# Altium schematic sheet mcu.SchDoc
size 209 x 297 mm; DocumentCode: Децимальный номер; SchemeType: Схема электрическая принципиальная; PageSetup: Record=PageOptionsZCenterHorizontal=TrueZCenterVertical=TrueZPrintScale=0.95ZXCorrection=1.00ZYCorrection=1.00ZPrintKind=2ZBorderSize=5000000ZLeftOffset=0ZBottomOffset=0ZOrientation=1ZPaperLength=1000ZPaperWidth=1000ZScale=100ZPaperSource=7ZPrintQuality=600ZMediaType=1ZDitherType=10ZPaperKind=A4 (210 x 297 мм)ZPrintScaleMode=1
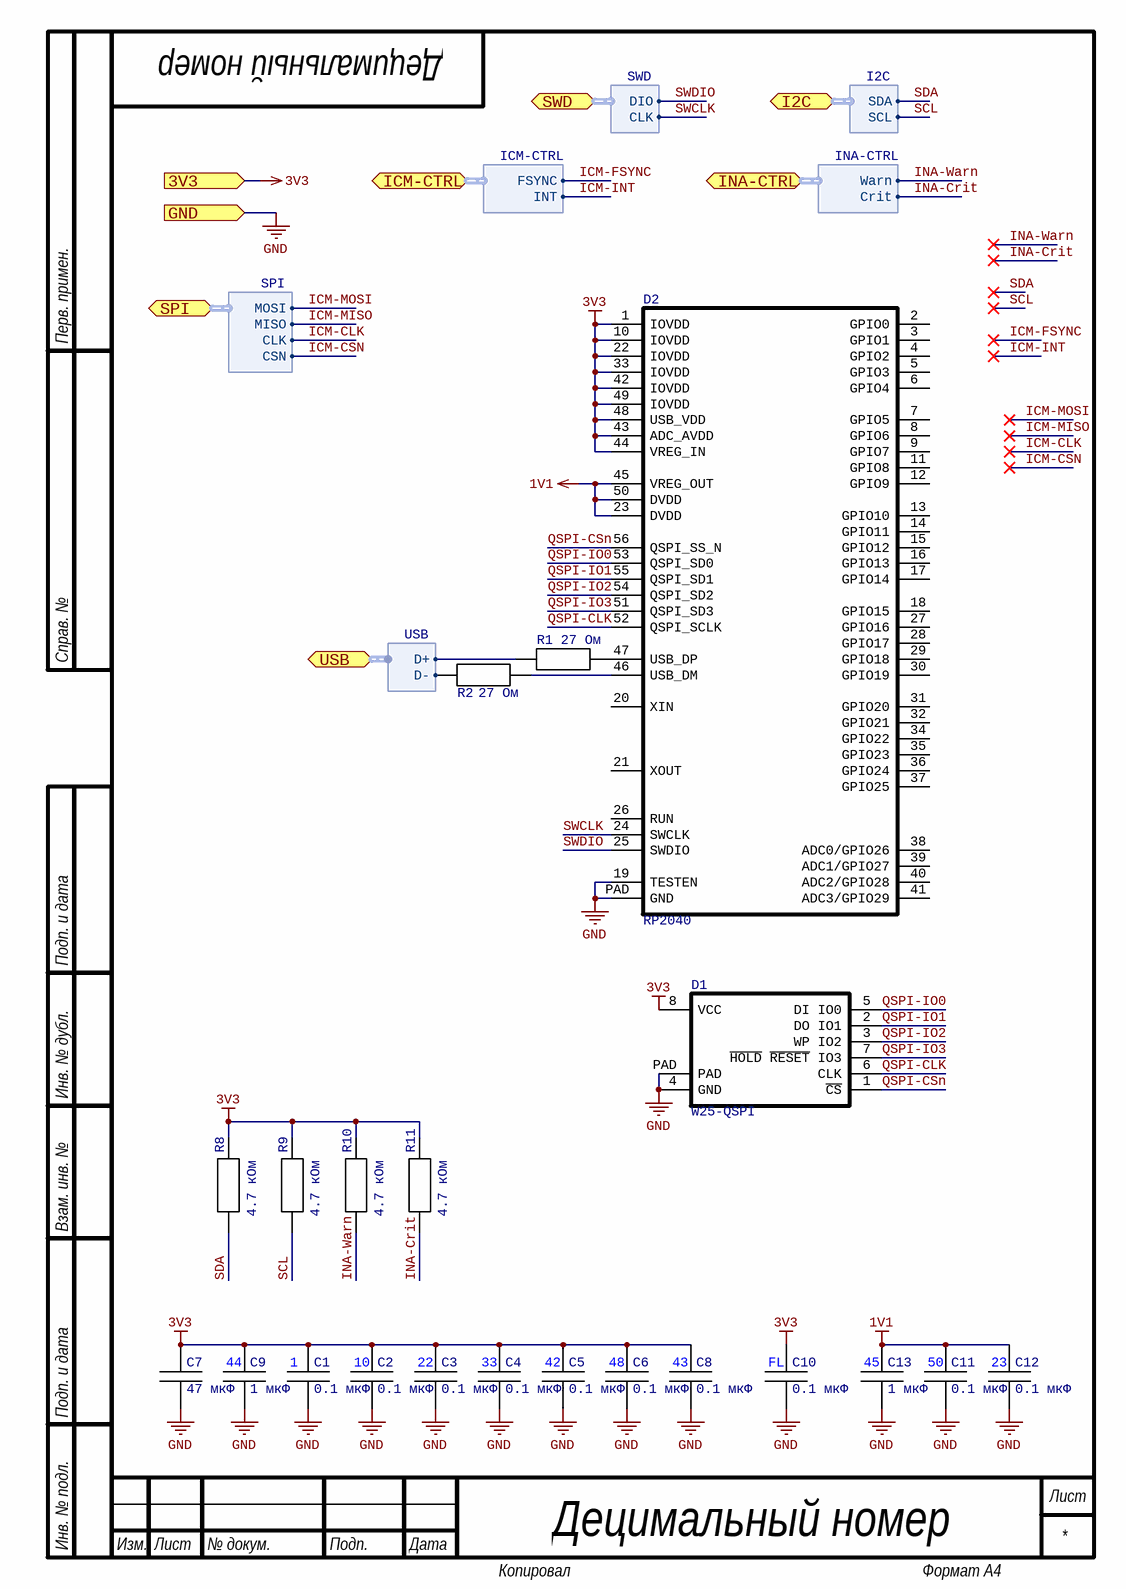
[diagram p0: mcu.SchDoc]

## Parts
C1  value 0.1 мкФ  [STD-0402]  (hidden comment: cap)
C2  value 0.1 мкФ  [STD-0402]  (hidden comment: cap)
C3  value 0.1 мкФ  [STD-0402]  (hidden comment: cap)
C4  value 0.1 мкФ  [STD-0402]  (hidden comment: cap)
C5  value 0.1 мкФ  [STD-0402]  (hidden comment: cap)
C6  value 0.1 мкФ  [STD-0402]  (hidden comment: cap)
C7  value 47 мкФ  [STD-0805]  (hidden comment: cap)
C8  value 0.1 мкФ  [STD-0402]  (hidden comment: cap)
C9  value 1 мкФ  [STD-0402]  (hidden comment: cap)
C10  value 0.1 мкФ  [STD-0402]  (hidden comment: cap)
C11  value 0.1 мкФ  [STD-0402]  (hidden comment: cap)
C12  value 0.1 мкФ  [STD-0402]  (hidden comment: cap)
C13  value 1 мкФ  [STD-0402]  (hidden comment: cap)
D1  W25-QSPI  [WSON-8]
D2  RP2040  [QFN-56]
R1  value 27 Ом  [STD-0402]  (hidden comment: res)
R2  value 27 Ом  [STD-0402]  (hidden comment: res)
R8  value 4.7 кОм  [STD-0402]  (hidden comment: res)
R9  value 4.7 кОм  [STD-0402]  (hidden comment: res)
R10  value 4.7 кОм  [STD-0402]  (hidden comment: res)
R11  value 4.7 кОм  [STD-0402]  (hidden comment: res)

## Ports
3V3 (in), GND (in), I2C (harness I2C), ICM-CTRL (harness ICM-CTRL), INA-CTRL (harness INA-CTRL), SPI (harness SPI), SWD (harness SWD), USB (harness USB)

## Harnesses
USB: D+, D-
I2C: SDA, SCL
INA-CTRL: Warn, Crit
SWD: DIO, CLK
ICM-CTRL: FSYNC, INT
SPI: MOSI, MISO, CLK, CSN

## Nets
1V1: C11.2 C12.2 C13.2 D2.23(DVDD) D2.45(VREG_OUT) D2.50(DVDD)
3V3: C1.2 C2.2 C3.2 C4.2 C5.2 C6.2 C7.2 C8.2 C9.2 C10.2 D1.8(VCC) D2.1(IOVDD) D2.10(IOVDD) D2.22(IOVDD) D2.33(IOVDD) D2.42(IOVDD) D2.43(ADC_AVDD) D2.44(VREG_IN) D2.48(USB_VDD) D2.49(IOVDD) R8.2 R9.2 R10.2 R11.2 ; port 3V3
GND: C1.1 C2.1 C3.1 C4.1 C5.1 C6.1 C7.1 C8.1 C9.1 C10.1 C11.1 C12.1 C13.1 D1.4(GND) D1.PAD D2.19(TESTEN) D2.PAD(GND) ; port GND
ICM-CLK: port SPI.CLK
ICM-CSN: port SPI.CSN
ICM-FSYNC: port ICM-CTRL.FSYNC
ICM-INT: port ICM-CTRL.INT
ICM-MISO: port SPI.MISO
ICM-MOSI: port SPI.MOSI
INA-Crit: R11.1 ; port INA-CTRL.Crit
INA-Warn: R10.1 ; port INA-CTRL.Warn
QSPI-CLK: D1.6(CLK) D2.52(QSPI_SCLK)
QSPI-CSn: D1.1(~{CS}) D2.56(QSPI_SS_N)
QSPI-IO0: D1.5(DI_IO0) D2.53(QSPI_SD0)
QSPI-IO1: D1.2(DO_IO1) D2.55(QSPI_SD1)
QSPI-IO2: D1.3(WP_IO2) D2.54(QSPI_SD2)
QSPI-IO3: D1.7(~{HOLD}_~{RESET}_IO3) D2.51(QSPI_SD3)
SCL: R9.1 ; port I2C.SCL
SDA: R8.1 ; port I2C.SDA
SWCLK: D2.24(SWCLK) ; port SWD.CLK
SWDIO: D2.25(SWDIO) ; port SWD.DIO
NetD2_46: D2.46(USB_DM) R2.2
NetD2_47: D2.47(USB_DP) R1.2
NetR1_1: R1.1 ; port USB.D+
NetR2_1: R2.1 ; port USB.D-

Not connected (* = marked no-connect by the designer): D2 2(GPIO0) 3(GPIO1) 4(GPIO2) 5(GPIO3) 6(GPIO4) 7(GPIO5) 8(GPIO6) 9(GPIO7) 11(GPIO8) 12(GPIO9) 13(GPIO10) 14(GPIO11) 15(GPIO12) 16(GPIO13) 17(GPIO14) 18(GPIO15) 20(XIN) 21(XOUT) 26(RUN) 27(GPIO16) 28(GPIO17) 29(GPIO18) 30(GPIO19) 31(GPIO20) 32(GPIO21) 34(GPIO22) 35(GPIO23) 36(GPIO24) 37(GPIO25) 38(ADC0/GPIO26) 39(ADC1/GPIO27) 40(ADC2/GPIO28) 41(ADC3/GPIO29)

## Notes on the sheet
- (near C9) 44
- (near C1) 1
- (near C2) 10
- (near C3) 22
- (near C4) 33
- (near C5) 42
- (near C6) 48
- (near C8) 43
- (near C10) FL
- (near C13) 45
- (near C11) 50
- (near C12) 23
- Перв. примен.
- Справ. №
- Подп. и дата
- Инв. № дубл.
- Взам. инв. №
- Изм.
- Лист
- № докум.
- Подп.
- Дата
- Инв. № подл.
- Копировал
- Формат А4

## Library data of the parts
C1-C6 C8 C10-C12 = C0402-0u1-50v-10%-X7R: Конденсатор; Part Number: C0402-0u1-50v-10%-X7R
C7 = C0805-47u-6.3v-20%-X5R: Конденсатор; Part Number: C0805-47u-6.3v-20%-X5R
C9 C13 = C0402-1u-16v-10%-X7R: Конденсатор; Part Number: C0402-1u-16v-10%-X7R
D1 = W25Q128JVPIQ: Flash память 16 МБайт; Part Number: W25Q128JVPIQ
D2 = RP2040: Микроконтроллер; Part Number: RP2040
R1 R2 = R0402-27r-1%-1/16W: Резистор; Part Number: R0402-27r-1%-1/16W
R8-R11 = R0402-4k7-1%-1/16W: Резистор; Part Number: R0402-4k7-1%-1/16W